# Altium schematic sheet Encoder Unit.SchDoc
size OrCAD A; SheetNumber: 1; SheetTotal: 1
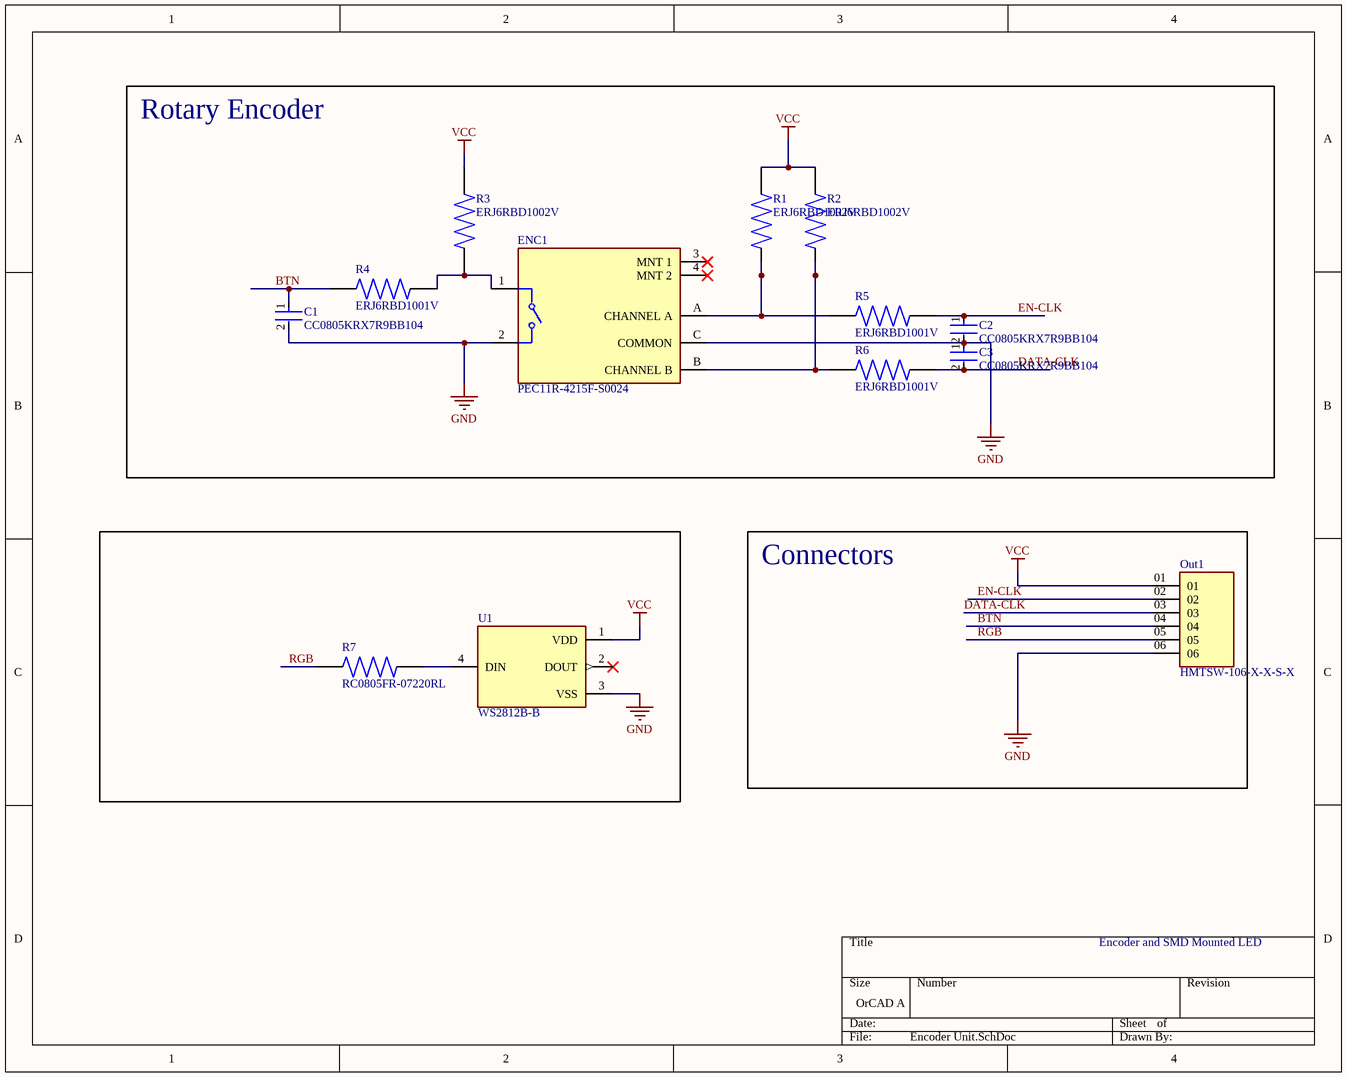
[diagram p0: Encoder Unit.SchDoc]

## Parts
C1  CC0805KRX7R9BB104  [FP-CC0805-0_85-IPC_C]
C2  CC0805KRX7R9BB104  [FP-CC0805-0_85-IPC_C]
C3  CC0805KRX7R9BB104  [FP-CC0805-0_85-IPC_C]
ENC1  PEC11R-4215F-S0024  [FP-PEC11R-4215F-S0024-MFG]
Out1  HMTSW-106-X-X-S-X  [SAMTEC_HMTSW-106-X-X-S-X]
R1  ERJ6RBD1002V  [RES_ERJ6RBD1002V]
R2  ERJ6RBD1002V  [RES_ERJ6RBD1002V]
R3  ERJ6RBD1002V  [RES_ERJ6RBD1002V]
R4  ERJ6RBD1001V  [RES_ERJ6RBD1001V]
R5  ERJ6RBD1001V  [RES_ERJ6RBD1001V]
R6  ERJ6RBD1001V  [RES_ERJ6RBD1001V]
R7  RC0805FR-07220RL  [RESC2012X60N]
U1  WS2812B-B  [LED_WS2812B-B]

## Blocks framed on the sheet
Rotary Encoder: C1-C3 ENC1 R1-R6
Connectors: Out1

## Nets
GND: C1.2 C2.2 C3.1 ENC1.2 ENC1.C(COMMON) Out1.06 U1.3(VSS)
VCC: Out1.01 R1.2 R2.2 R3.2 U1.1(VDD)
BTN: C1.1 Out1.04 R4.1
DATA-CLK: C3.2 Out1.03 R6.2
EN-CLK: C2.1 Out1.02 R5.2
RGB: Out1.05 R7.1
NetENC1_1: ENC1.1 R3.1 R4.2
NetENC1_A: ENC1.A(CHANNEL_A) R1.1 R5.1
NetENC1_B: ENC1.B(CHANNEL_B) R2.1 R6.1
NetR7_2: R7.2 U1.4(DIN)

Not connected (* = marked no-connect by the designer): ENC1 3(MNT_1)* 4(MNT_2)*; U1 2(DOUT)*

## Notes on the sheet
- Encoder and SMD Mounted LED

## Library data of the parts
C1-C3 = CMP-2100-03606-3: CAP CER 0.1UF 50V X7R 0805; Manufacturer: Yageo; Tolerance: 0.1; Capacitance: 100 nF; Value: 100 nF; Material: Ceramic; Device Class L1: Passive Components; ComponentLink2Description: Datasheet; Package: CC0805-0.85; Manufacturer Part Number: CC0805KRX7R9BB104; Digikey Description: CAP CER 0.1UF 50V X7R 0805; Device Class L3: Ceramic Capacitors; Temperature: -30°C to +85°C; Temperature Characteristic: X7R; Voltage Rating: 50 V; Height: 0.95mm; RoHS: TRUE; Ipc Land Pattern Name: CAPC200125X85; Device Class L2: Capacitors; Category: Cap; Temperature Range Low: -30°C; Temperature Range High: +85°C; Mouser Description: Multilayer Ceramic Capacitors MLCC - SMD/SMT 100nF 50V X7R 10%; Footprint Url: http://www.yageo.com/exep/pages/download/literatures/UPY-C_GEN_24.pdf; Automotive: No; Octopart: https://octopart.com/cc0805krx7r9bb104-yageo-192993; Lead Free: Yes; ComponentLink2URL: http://www.yageo.com/documents/recent/UPY-GPHC_Y5V_6.3V-to-50V_8.pdf
ENC1 = CMP-1747-00012-2: ROTARY ENCODER MECHANICAL 24PPR; Hole Diameter: 1.8mm; Output Type: Quadrature; Pulses per Revolution: 24; Number of Channels: 2; Built in Switch: Yes; Min Operating Temperature: -30°C; Series: PEC11R; Type: Mechanical; Package Quantity: 150; Length: 21.5mm; Max Operating Temperature: 70°C; Encoder Type: Mechanical; Height: 13.4mm; Detent: Yes; Packaging: Bulk; Orientation: Vertical; Width: 12.5mm; Termination: PC Pins; Mount: Through Hole; REACH SVHC: No SVHC; Radiation Hardening: No; RoHS Compliant: Yes; LCSC Part Number: C143790
Out1 = HMTSW-106-X-X-S-X: .100 High-Temp Variable Post Height Terminal Strip; MF: SAMTEC; MP: HMTSW-106-07-T-S-200; SnapEDA_Link: https://www.snapeda.com/parts/HMTSW-106-07-T-S-200/Samtec/view-part/?ref=snap; Package: None; Value: *; Check_prices: https://www.snapeda.com/parts/HMTSW-106-07-T-S-200/Samtec/view-part/?ref=eda; LCSC Part Number: C3334125
R1-R3 = ERJ6RBD1002V: Precision Thick Film Surface Mnt Resistor 0805 10kOhm +/-0.5% 0.1W +/-50ppm/degC | Panasonic Electronic Components ERJ6RBD1002V; SnapEDA_Link: https://www.snapeda.com/parts/ERJ6RBD1002V/Panasonic/view-part/?ref=snap; Package: 805-2 Panasonic; Value: *; MF: Panasonic; MP: ERJ6RBD1002V; Check_prices: https://www.snapeda.com/parts/ERJ6RBD1002V/Panasonic/view-part/?ref=eda
R4-R6 = ERJ6RBD1001V: Precision Thick Film Surface Mnt Resistor 0805 1kOhm +/-0.5% 0.1W +/-50ppm/degC | Panasonic Electronic Components ERJ6RBD1001V; SnapEDA_Link: https://www.snapeda.com/parts/ERJ6RBD1001V/Panasonic/view-part/?ref=snap; Package: 805-2 Panasonic; Value: *; MF: Panasonic; MP: ERJ6RBD1001V; Check_prices: https://www.snapeda.com/parts/ERJ6RBD1001V/Panasonic/view-part/?ref=eda
R7 = RC0805FR-07220RL: 220 Ohm Â±1% 0,125W, 1/8W Ã‡ip Direnci 0805 (2012 Metrik) Nem DirenÃ§li KalÄ±n Film; MF: Yageo; SnapEDA_Link: https://www.snapeda.com/parts/RC0805FR-07220RL/Yageo/view-part/?ref=snap; Package: 2012 Yageo; Value: *; MP: RC0805FR-07220RL; Check_prices: https://www.snapeda.com/parts/RC0805FR-07220RL/Yageo/view-part/?ref=eda
U1 = WS2812B-B: Intelligent control LED integrated light source; Availability: Unavailable; Price: None; Package: None; MP: WS2812B-B; Value: *; LCSC Part Number: C114586